# EAGLE design CNC3AX_V2 (EAGLE 4.16)
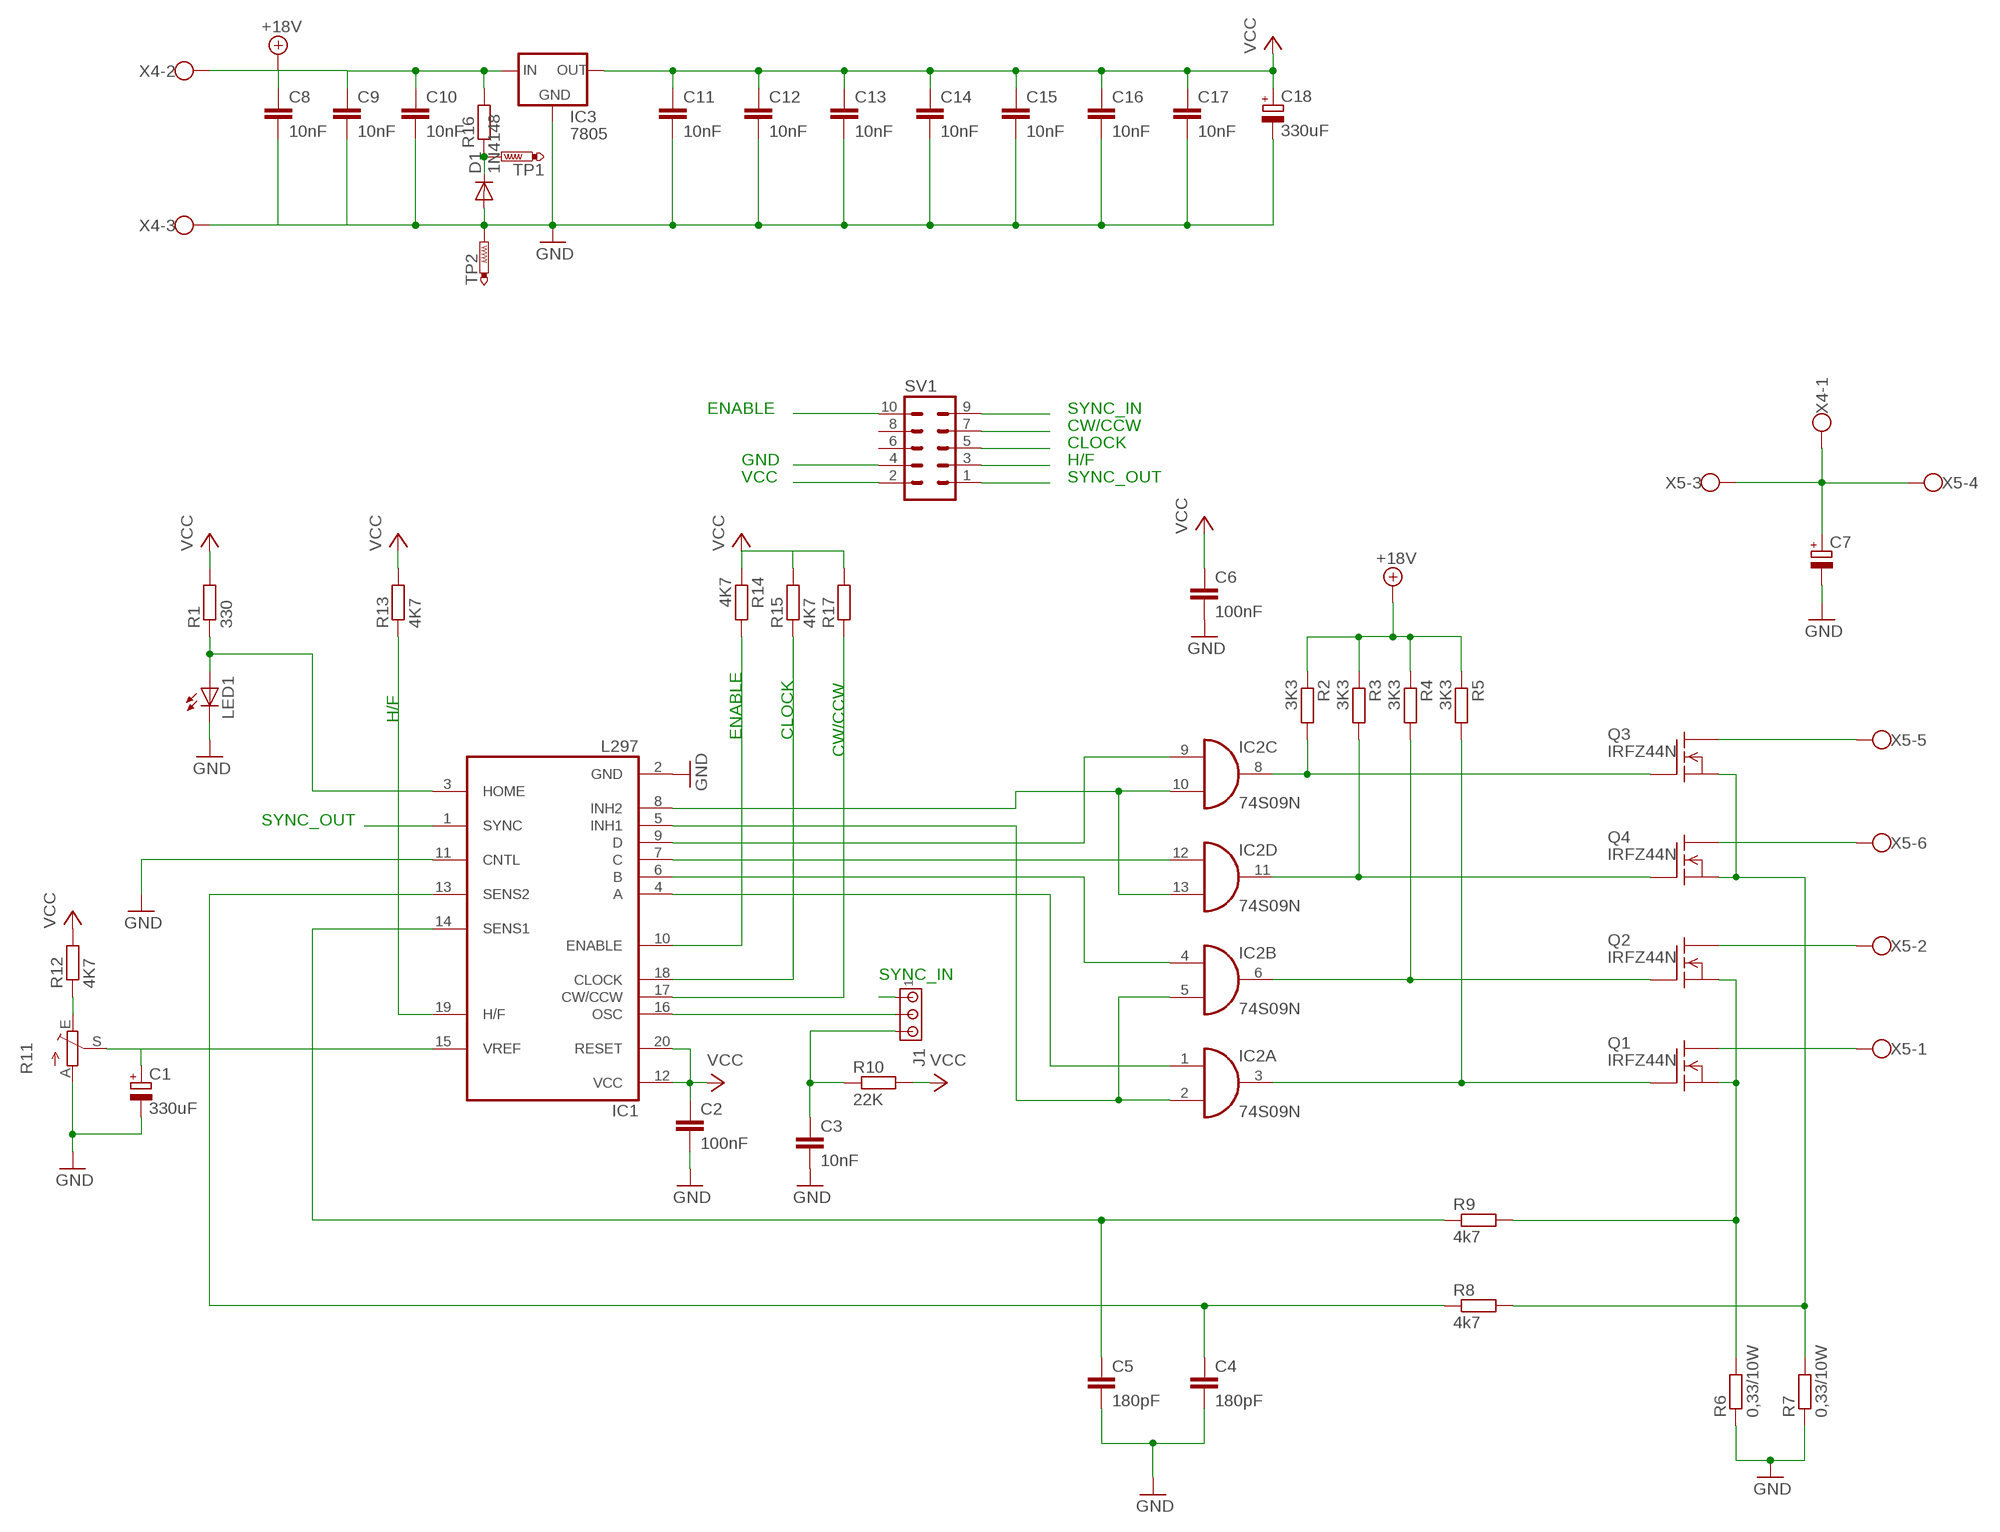
[diagram p0: schematic, sheet 1]

## Parts
C1  330uF  CPOL-EUE5-10.5  [E5-10,5]
C2  100nF  C-EU102-043X133  [C102-043X133]
C3  10nF  C-EU050-030X075  [C050-030X075]
C4  180pF  C-EU050-025X075  [C050-025X075]
C5  180pF  C-EU050-025X075  [C050-025X075]
C6  100nF  C-EU102-043X133  [C102-043X133]
C7  CPOL-EUE5-10.5  [E5-10,5]
C8  10nF  C-EU050-024X044  [C050-024X044]
C9  10nF  C-EU050-024X044  [C050-024X044]
C10  10nF  C-EU050-024X044  [C050-024X044]
C11  10nF  C-EU050-024X044  [C050-024X044]
C12  10nF  C-EU050-024X044  [C050-024X044]
C13  10nF  C-EU050-024X044  [C050-024X044]
C14  10nF  C-EU050-024X044  [C050-024X044]
C15  10nF  C-EU050-024X044  [C050-024X044]
C16  10nF  C-EU050-024X044  [C050-024X044]
C17  10nF  C-EU050-024X044  [C050-024X044]
C18  330uF  CPOL-EUE5-10.5  [E5-10,5]
D1  1N4148  [DO35-10]
IC1  L297  [DIL20]
IC2  74S09N  [DIL14]
IC3  7805  78XXS  [78XXS]
J1  MTA03-100  [10X03MTA]
LED1  LED5MM  [LED5MM]
Q1  IRFZ44N  IRF620  [TO220]
Q2  IRFZ44N  IRF620  [TO220]
Q3  IRFZ44N  IRF620  [TO220]
Q4  IRFZ44N  IRF620  [TO220]
R1  330  R-EU_0207/10  [0207/10]
R2  3K3  R-EU_0207/10  [0207/10]
R3  3K3  R-EU_0207/10  [0207/10]
R4  3K3  R-EU_0207/10  [0207/10]
R5  3K3  R-EU_0207/10  [0207/10]
R6  0,33/10W  R-EU_0613/15  [P0613/15]
R7  0,33/10W  R-EU_0613/15  [P0613/15]
R8  4k7  R-EU_0207/10  [0207/10]
R9  4k7  R-EU_0207/10  [0207/10]
R10  22K  R-EU_0207/5V  [0207/5V]
R11  TRIM_EU-CA9V  [CA9V]
R12  4K7  R-EU_0207/10  [0207/10]
R13  4K7  R-EU_0207/2V  [0207/2V]
R14  4K7  R-EU_0207/10  [0207/10]
R15  4K7  R-EU_0207/5V  [0207/5V]
R16  R-EU_0204/7  [0204/7]
R17  R-EU_0207/7  [0207/7]
SV1  MA05-2  [MA05-2]
TP1  PTR1PAD1-13Y  [P1-13Y]
TP2  PTR1PAD1-13Y  [P1-13Y]
X4  W237-103  [W237-103]
X5  W237-136  [W237-136]

## Nets
+18V: C8.1 C9.1 C10.1 IC3.IN R2.1 R3.1 R4.1 R5.1 R16.2 X4.2
CLOCK: IC1.18(CLOCK) R15.1 SV1.5
CW/CCW: IC1.17(CW/CCW) R17.1 SV1.7
ENABLE: IC1.10(ENABLE) R14.2 SV1.10
GND: C1.- C2.2 C3.2 C4.2 C5.2 C6.2 C7.- C8.2 C9.2 C10.2 C11.2 C12.2 C13.2 C14.2 C15.2 C16.2 C17.2 C18.- D1.A IC1.2(GND) IC1.11(CNTL) IC3.GND LED1.K(C) R6.1 R7.1 R11.A SV1.4 TP2.1(TP) X4.3
H/F: IC1.19(H/F) R13.1 SV1.3
N$1: IC1.4(A) IC2.1(A:I0)
N$2: IC1.6(B) IC2.4(B:I0)
N$3: IC1.7(C) IC2.12(D:I0)
N$4: IC1.9(D) IC2.9(C:I0)
N$5: IC1.5(INH1) IC2.2(A:I1) IC2.5(B:I1)
N$6: IC1.8(INH2) IC2.10(C:I1) IC2.13(D:I1)
N$7: D1.C R16.1 TP1.1(TP)
N$9: IC1.3(HOME) LED1.A R1.1
N$10: Q4.2(D) X5.6
N$15: Q3.2(D) X5.5
N$16: Q2.2(D) X5.2
N$17: IC2.8(C:O) Q3.1(G) R2.2
N$18: IC2.11(D:O) Q4.1(G) R3.2
N$19: IC2.6(B:O) Q2.1(G) R4.2
N$20: IC2.3(A:O) Q1.1(G) R5.2
N$21: Q3.3(S) Q4.3(S) R7.2 R8.2
N$22: Q1.3(S) Q2.3(S) R6.2 R9.2
N$23: C5.1 IC1.14(SENS1) R9.1
N$24: C4.1 IC1.13(SENS2) R8.1
N$25: C3.1 J1.3 R10.1
N$26: C1.+ IC1.15(VREF) R11.S
N$27: IC1.16(OSC) J1.2
N$28: R11.E R12.1
N$29: Q1.2(D) X5.1
SYNC_IN: J1.1 SV1.9
SYNC_OUT: IC1.1(SYNC) SV1.1
VCC: C2.1 C6.1 C11.1 C12.1 C13.1 C14.1 C15.1 C16.1 C17.1 C18.+ IC1.12(VCC) IC1.20(RESET) IC3.OUT R1.2 R10.2 R12.2 R13.2 R14.1 R15.2 R17.2 SV1.2
VMOTOR: C7.+ X4.1 X5.3 X5.4
Unconnected: SV1.6 SV1.8

## Notes on the sheet
- ENABLE | SYNC_IN
- CW/CCW
- CLOCK
- GND | H/F
- VCC | SYNC_OUT
- H/F
- ENABLE | CLOCK
- CW/CCW
- SYNC_OUT
- SYNC_IN

## Power pins joined to a net without a drawn wire
GND: IC2.7(P:GND)
VCC: IC2.14(P:VCC)

## Library data of the parts
C1 C7 C18 = rcl:CPOL-EU: POLARIZED CAPACITOR, European symbol
C2-C6 C8-C17 = rcl:C-EU: CAPACITOR, European symbol
D1 = diode:1N4148: DIODE high speed (Philips)
IC1 = st-microelectronics:L297: STEPPER MOTOR CONTROLLER
IC2 = 74xx-eu:74*09: Quad 2-input AND gate, open collector
IC3 = v-reg:78XXS: VOLTAGE REGULATOR
J1 = con-amp:MTA03-100: AMP connector
LED1 = led:LED: LED OSRAM: - CHIPLED LG R971, LG N971, LY N971, LG Q971, LY Q971, LO R971, LY R971 LH N974, LH R974 LS Q976, LO Q976, LY Q976 LO Q996 - Hyper CHIPLED LW Q18S LB Q993, LB Q99A, LB R99A - SideLED LS A670, LO A670, LY A670, LG A670, LP A670 LB A673, LV A673, LT A673, LW A673 LH A674 LY A675 LS A676, LA A676, LO A676, LY A676, LW A676 LS A679, LY A679, LG A679 - Hyper Micro SIDELED® LS Y876, LA Y876, LO Y876, LY Y876 LT Y87S - SmartLED LW L88C, LW L88S LB L89C, LB L89S, LG L890 LS L89K, LO L89K, LY L89K LS L896, LA L896, LO L896, LY L896 - TOPLED LS T670, LO T670, LY T670, LG T670, LP T670 LSG T670, LSP T670, LSY T670, LOP T670, LYG T670 LG T671, LOG T671, LSG T671 LB T673, LV T673, LT T673, LW T673 LH T674 LS T676, LA T676, LO T676, LY T676, LB T676, LH T676, LSB T676, LW T676 LB T67C, LV T67C, LT T67C, LS T67K, LO T67K, LY T67K, LW E67C LS E67B, LA E67B, LO E67B, LY E67B, LB E67C, LV E67C, LT E67C LW T67C LS T679, LY T679, LG T679 LS T770, LO T770, LY T770, LG T770, LP T770 LB T773, LV T773, LT T773, LW T773 LH T774 LS E675, LA E675, LY E675, LS T675 LS T776, LA T776, LO T776, LY T776, LB T776 LHGB T686 LT T68C, LB T68C - Hyper Mini TOPLED® LB M676 - Mini TOPLED Santana® LG M470 LS M47K, LO M47K, LY M47K Source: http://www.osram.convergy.de/
Q1-Q4 = transistor-fet:IRF620: N-Channel Enhancement MOSFET (HEXFET); 200V; 5,2A; 0,8Ohm
R1-R10 R12-R17 = rcl:R-EU_: RESISTOR, European symbol
R11 = pot:TRIM_EU-: POTENTIOMETER
SV1 = con-lstb:MA05-2: PIN HEADER
TP1 TP2 = testpad:PTR1: TEST PIN
X4 = con-wago-500:W237-103: WAGO SCREW CLAMP
X5 = con-wago-500:W237-136: WAGO SCREW CLAMP

## Board
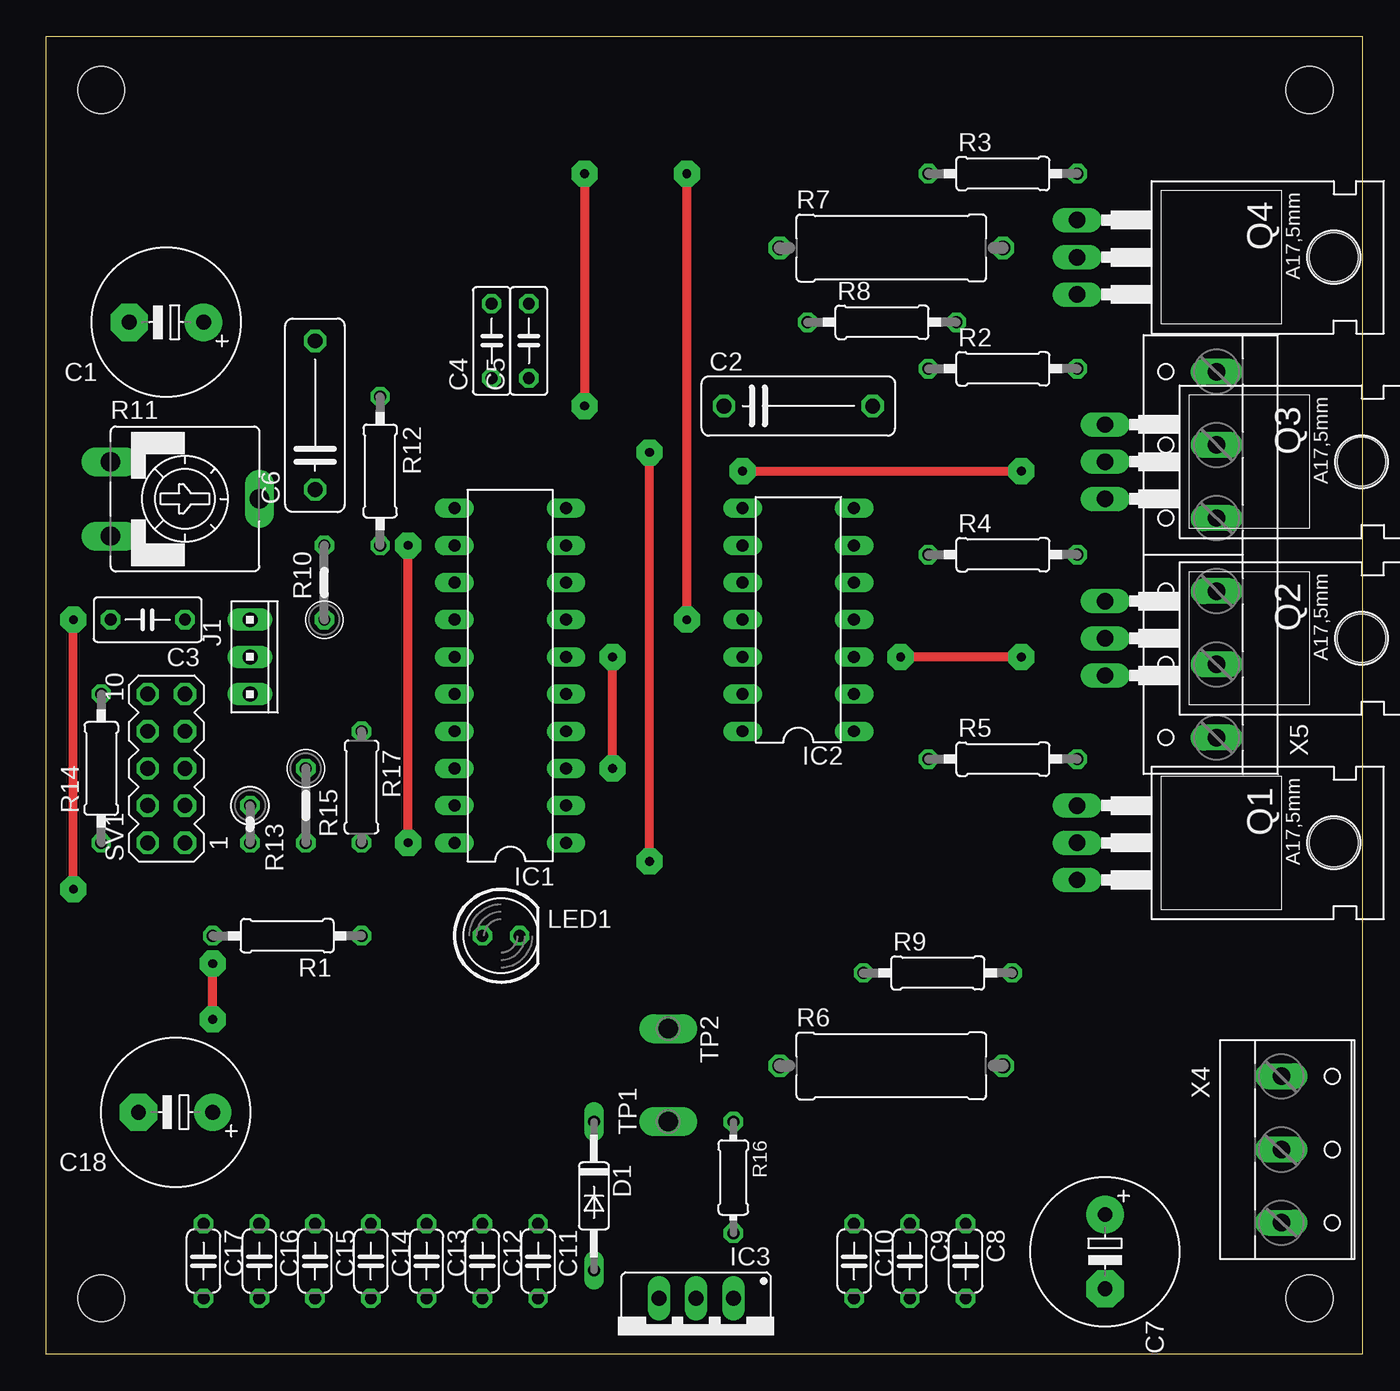
[diagram p1: board, top side]
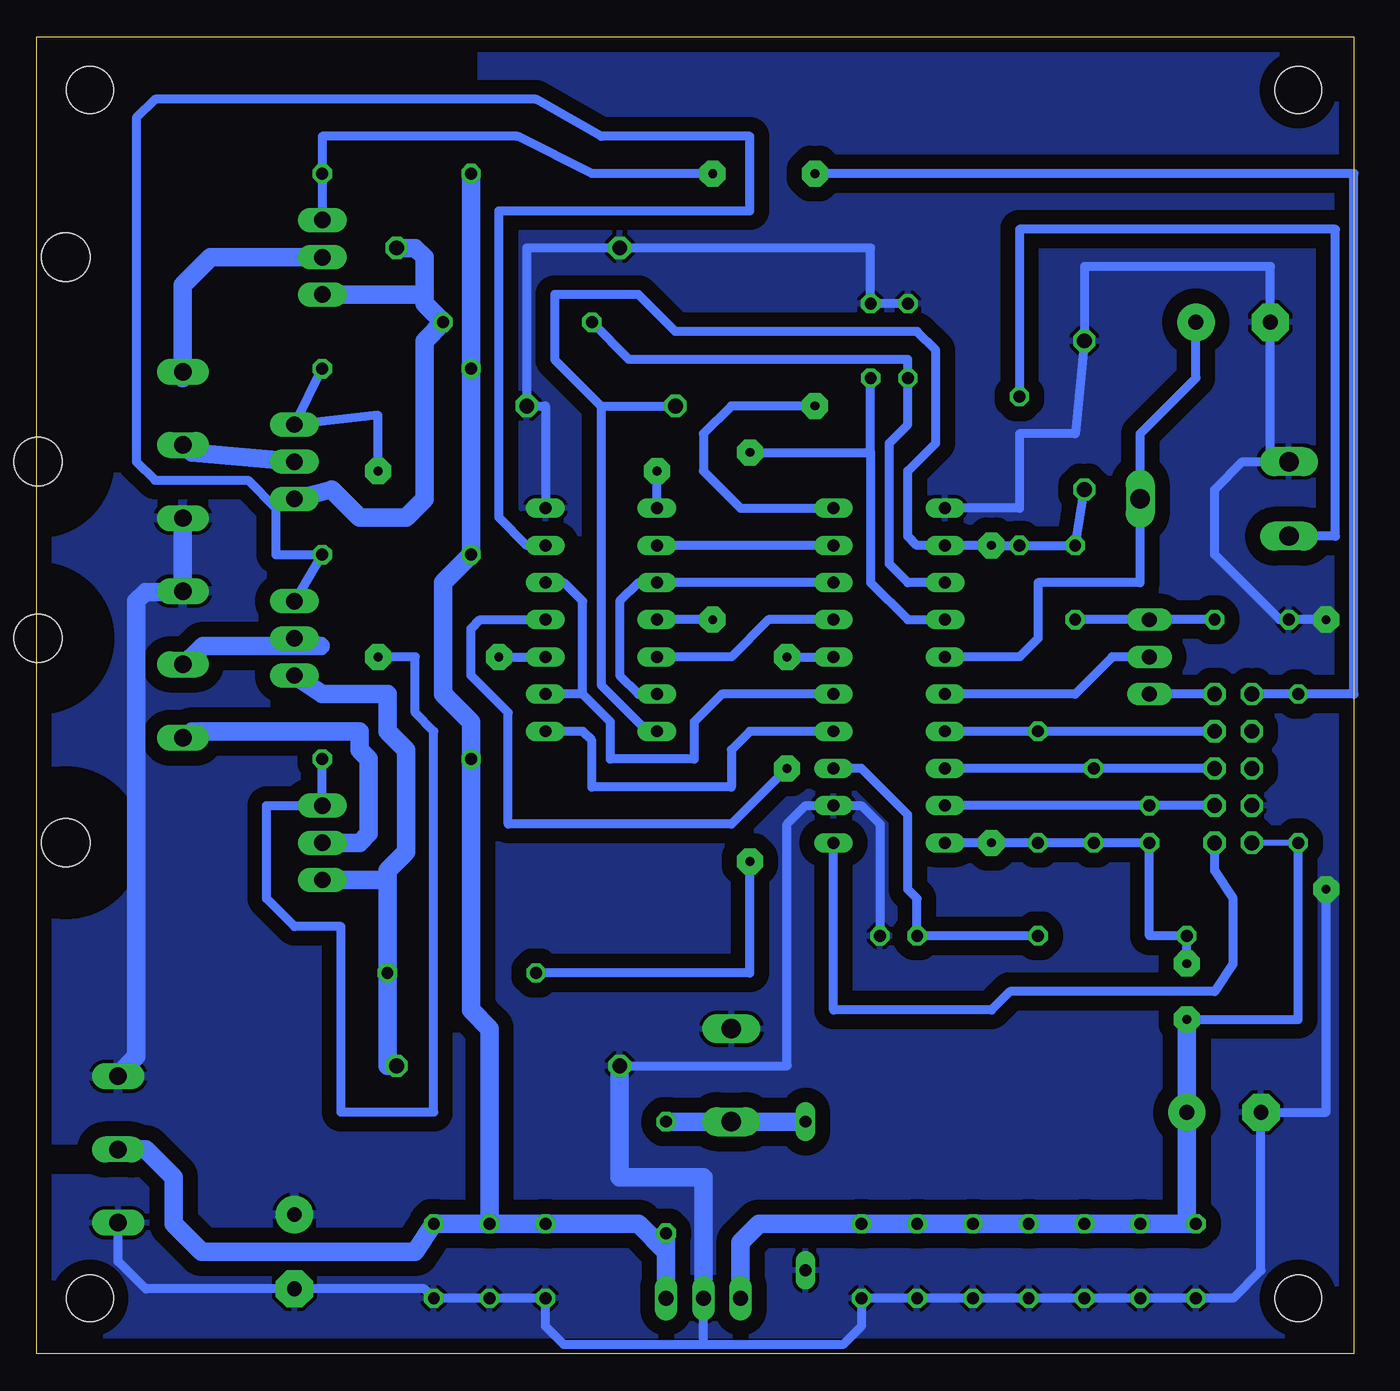
[diagram p2: board, bottom side, seen from below]

Size 90 x 90 mm. Coordinates in mm from the lower left corner, seen from the top.
Outline: 0,90 0,0 90,0 90,90 0,90
Copper layers (1*16): Top 0.035mm / dielectric 1.5mm / Bottom 0.035mm
Design rules "default": minimum track width 10mil, minimum drill 24mil, track to track 8mil, track to pad 8mil, pad to pad 8mil, via to via 8mil, smd to smd 8mil, copper to edge 40mil, drill to drill 8mil, minimum pad ring 10mil, minimum via ring 8mil, stop-mask expansion 4mil, vias tented up to drill 0mil, thermal gap 10mil
Holes 3.2 mm at 86.36,3.81 3.81,86.36 86.36,86.36 3.81,3.81

### Footprints (pad centres in the part's own frame; a part is rotated, then mirrored left to right if it is on the bottom)
E5-10,5 = drill 1.016 pad 2.54: + -2.54,0 | drill 1.016 pad 2.54 octagon: - 2.54,0
C102-043X133 = drill 1.016 octagon: 1 -5.08,0; 2 5.08,0
C050-030X075 = drill 0.813 octagon: 1 -2.54,0; 2 2.54,0
C050-025X075 = drill 0.813 octagon: 1 -2.54,0; 2 2.54,0
C050-024X044 = drill 0.813 octagon: 1 -2.54,0; 2 2.54,0
DO35-10 = drill 0.813 long: A 5.08,0; C -5.08,0
DIL20 = drill 0.813 long: 1 -11.43,-3.81; 2 -8.89,-3.81; 3 -6.35,-3.81; 4 -3.81,-3.81; 5 -1.27,-3.81; 6 1.27,-3.81; 7 3.81,-3.81; 8 6.35,-3.81; 9 8.89,-3.81; 10 11.43,-3.81; 11 11.43,3.81; 12 8.89,3.81; 13 6.35,3.81; 14 3.81,3.81; 15 1.27,3.81; 16 -1.27,3.81; 17 -3.81,3.81; 18 -6.35,3.81; 19 -8.89,3.81; 20 -11.43,3.81
DIL14 = drill 0.813 long: 1 -7.62,-3.81; 2 -5.08,-3.81; 3 -2.54,-3.81; 4 0,-3.81; 5 2.54,-3.81; 6 5.08,-3.81; 7 7.62,-3.81; 8 7.62,3.81; 9 5.08,3.81; 10 2.54,3.81; 11 0,3.81; 12 -2.54,3.81; 13 -5.08,3.81; 14 -7.62,3.81
78XXS = drill 1.016 long: GND 0,-2.54; IN -2.54,-2.54; OUT 2.54,-2.54
10X03MTA = drill 1.016 long: 1 2.54,0; 2 0,0; 3 -2.54,0
LED5MM = drill 0.813 octagon: A -1.27,0; K 1.27,0
TO220 = drill 1.118 long: 1 -2.54,-6.35; 2 0,-6.35; 3 2.54,-6.35 | hole 3.302: 0,11.176
0207/10 = drill 0.813 octagon: 1 -5.08,0; 2 5.08,0
P0613/15 = drill 1.016 octagon: 1 -7.62,0; 2 7.62,0
0207/5V = drill 0.813 octagon: 1 -2.54,0; 2 2.54,0
CA9V = drill 1.321 long: A -2.54,-5.08; E 2.54,-5.08; S 0,5.08
0207/2V = drill 0.813 octagon: 1 -1.27,0; 2 1.27,0
0204/7 = drill 0.813 octagon: 1 -3.81,0; 2 3.81,0
0207/7 = drill 0.813 octagon: 1 -3.81,0; 2 3.81,0
MA05-2 = drill 1.016 octagon: 1 -5.08,-1.27; 2 -5.08,1.27; 3 -2.54,-1.27; 4 -2.54,1.27; 5 0,-1.27; 6 0,1.27; 7 2.54,-1.27; 8 2.54,1.27; 9 5.08,-1.27; 10 5.08,1.27
P1-13Y = drill 1.321 pad 1.905 long: 1 0,0
W237-103 = drill 1.194 long: 1 -5,-1.29; 2 0,-1.29; 3 5,-1.29
W237-136 = drill 1.194 long: 1 -12.5,-1.27; 2 -7.5,-1.27; 3 -2.5,-1.27; 4 2.5,-1.27; 5 7.5,-1.27; 6 12.5,-1.27

### Placement (x,y rotation side)
C1  8.25,70.48 180 top
C2  51.43,64.77 0 top
C3  6.98,50.16 180 top
C4  30.47,69.21 90 top
C5  33.02,69.21 90 top
C6  18.41,64.13 90 top
C7  72.39,6.98 270 top
C8  62.86,6.35 270 top
C9  59.05,6.35 270 top
C10  55.24,6.35 270 top
C11  33.65,6.35 270 top
C12  29.84,6.35 270 top
C13  26.03,6.35 270 top
C14  22.22,6.35 270 top
C15  18.41,6.35 270 top
C16  14.6,6.35 270 top
C17  10.79,6.35 270 top
C18  8.88,16.5 180 top
D1  37.46,10.79 270 top
IC1  31.74,46.35 90 top
IC2  51.43,50.16 90 top
IC3  44.45,1.27 180 top
J1  13.96,47.62 270 top
LED1  31.11,28.57 0 top
Q1  76.83,34.92 270 top
Q2  78.73,48.89 270 top
Q3  78.73,60.95 270 top
Q4  76.83,74.92 270 top
R1  16.5,28.57 180 top
R2  65.4,67.3 0 top
R3  65.4,80.64 0 top
R4  65.4,54.6 0 top
R5  65.4,40.63 0 top
R6  57.78,19.68 0 top
R7  57.78,75.56 0 top
R8  57.14,70.48 0 top
R9  60.95,26.03 0 top
R10  19.04,52.7 90 top
R11  9.52,58.41 270 top
R12  22.86,60.32 270 top
R13  13.96,36.19 270 top
R14  3.81,40 90 top
R15  17.77,37.46 270 top
R16  46.98,12.06 270 top
R17  21.59,38.73 270 top
SV1  8.25,40 90 top
TP1  42.54,15.87 90 top
TP2  42.54,22.22 270 top
X4  85.72,13.96 270 top
X5  78.73,54.6 90 top

### Tracks (layer width: path | path; a pad name or v marks a point on that pad's centre or on a via)
+18V
  Bottom 1.27: X4.2 82.55,13.96 80.64,12.06 80.64,8.88 78.73,6.98 64.13,6.98 C8.1 C9.1 | C9.1 C10.1 48.89,8.88 46.98,6.98 | IC3.IN 46.98,6.98 | C9.1 59.05,22.22 60.32,23.49 R5.1 60.32,43.17 62.23,45.08 62.23,52.7 R4.1 60.32,57.78 | 60.32,57.78 R2.1 | 60.32,57.78 60.32,57.14 | 60.32,57.78 R3.1 | 46.98,6.98 R16.2
CLOCK
  Bottom 0.61: IC1.18 R15.1 SV1.5
CW/CCW
  Bottom 0.61: SV1.7 R17.1 IC1.17
ENABLE  (via drill 0.6 pad 1.78)
  Top 0.61: v36.83,80.64 v36.83,64.77
  Bottom 0.61: IC1.10 41.91,57.78 44.45,60.32 44.45,62.86 42.54,64.77 v36.83,64.77 | v36.83,80.64 -0.01,80.64 -0.01,45.08 R14.2 SV1.10
GND  (via drill 0.6 pad 1.78)
  Top 0.61: v1.9,31.74 v1.9,50.16
  Bottom 0.61: IC1.11 22.86,57.78 22.86,62.86 19.04,62.86 C6.2 18.41,74.29 5.71,74.29 C1.- 5.71,60.95 | X4.3 84.43,6.33 82.55,4.44 C7.- 63.5,4.44 C8.2 C9.2 C10.2 55.24,1.9 53.97,0.63 44.45,0.63 | 44.45,0.63 34.92,0.63 33.65,1.9 C11.2 C12.2 C13.2 C14.2 C15.2 C16.2 C17.2 8.25,3.81 6.35,5.71 C18.- 1.9,16.5 v1.9,31.74 | 44.45,0.63 IC3.GND | C4.2 C5.2 33.02,75.56 R7.1 56.51,75.56 C2.2 55.24,64.77 IC2.7 | 5.71,60.95 R11.A | 5.71,60.95 7.62,60.95 9.52,59.05 9.52,54.6 5.08,50.16 C3.2 v1.9,50.16 | R6.1 38.73,19.68 38.73,36.19 37.46,37.46 IC1.2 33.65,37.46 32.38,36.19 LED1.K
  Bottom 1.27: R6.1 50.16,12.06 44.45,12.06 IC3.GND
  pour Bottom (isolate 1.016): -0.01,89.53 59.69,89.53 59.69,12.06 89.53,12.06 89.53,0.63 -0.01,0.63
H/F
  Bottom 0.61: IC1.19 R13.1 SV1.3
N$1
  Bottom 0.61: IC1.4 41.27,42.54 42.54,41.27 42.54,38.73 52.06,38.73 52.06,41.91 52.7,42.54 IC2.1
N$2  (via drill 0.6 pad 1.78)
  Top 0.61: v38.73,40 v38.73,47.62
  Bottom 0.61: v38.73,47.62 IC1.6 | IC2.4 59.69,50.16 60.32,49.52 60.32,46.35 57.78,43.81 57.78,36.19 42.54,36.19 v38.73,40
N$3
  Bottom 0.61: IC2.12 42.54,47.62 40,50.16 IC1.7
N$4
  Bottom 0.61: IC1.9 IC2.9
N$5
  Bottom 0.61: IC1.5 43.17,45.08 45.08,43.17 45.08,40.63 50.8,40.63 50.8,43.17 52.7,45.08 | IC2.5 53.97,52.7 52.7,51.43 52.7,45.08 | 52.7,45.08 IC2.2
N$6
  Bottom 0.61: IC1.8 IC2.10 48.89,52.7 50.16,51.43 50.16,46.35 48.89,45.08 IC2.13
N$7
  Bottom 1.27: R16.1 TP1.1 D1.C
N$9
  Bottom 0.61: IC1.3 33.65,40 30.47,36.83 30.47,31.74 29.84,31.11 LED1.A R1.1
N$10
  Bottom 1.27: Q4.2 78.1,74.92 80,73.02 X5.6 80,66.67
N$15
  Bottom 1.27: X5.5 80,62.23 79.37,61.59 Q3.2
N$16
  Bottom 1.27: Q2.2 70.6,48.38 78.61,48.38 80,46.98 X5.2
N$17  (via drill 0.6 pad 1.78)
  Top 0.61: v47.62,60.32 v66.67,60.32
  Bottom 0.61: IC2.8 v47.62,60.32 | v66.67,60.32 66.67,64.13 Q3.1 R2.2
N$18  (via drill 0.6 pad 1.78)
  Top 0.61: v43.81,50.16 v43.81,80.64
  Bottom 0.61: v43.81,50.16 IC2.11 | v43.81,80.64 52.06,80.64 57.14,83.18 70.48,83.18 R3.2 Q4.1
N$19
  Bottom 0.61: IC2.6 56.51,55.24 58.41,57.14 58.41,78.1 41.27,78.1 41.27,83.18 51.43,83.18 55.88,85.72 81.91,85.72 83.18,84.45 83.18,60.95 81.91,59.69 75.56,59.69 73.66,57.78 73.66,54.6 R4.2 Q2.1
N$20  (via drill 0.6 pad 1.78)
  Top 0.61: v66.67,47.62 v58.41,47.62
  Bottom 0.61: v66.67,47.62 64.13,47.62 64.13,43.81 62.86,42.54 62.86,16.5 69.21,16.5 69.21,29.2 72.39,29.2 74.29,31.11 74.29,37.46 Q1.1 R5.2 | v58.41,47.62 IC2.3
N$21
  Bottom 1.27: Q3.3 69.84,59.05 67.94,57.14 64.77,57.14 63.5,58.41 63.5,69.21 R8.2 63.5,71.75 63.5,72.39 | R7.2 64.13,75.56 63.5,74.92 63.5,72.39 | 63.5,72.39 Q4.3
N$22
  Bottom 1.27: R6.2 66.03,19.68 R9.2 | R9.2 66.03,32.38 Q1.3 | Q2.3 70.48,45.08 66.03,45.08 66.03,42.54 64.77,41.27 64.77,34.28 66.03,33.02 R9.2
N$23  (via drill 0.6 pad 1.78)
  Top 0.61: v41.27,33.65 v41.27,61.59
  Bottom 0.61: IC1.14 30.47,50.16 33.02,52.7 33.02,61.59 | 33.02,61.59 C5.1 | R9.1 41.27,26.03 v41.27,33.65 | v41.27,61.59 33.02,61.59
N$24
  Bottom 0.61: IC1.13 30.47,52.7 31.74,53.97 31.74,62.23 30.47,63.5 C4.1 30.47,67.94 49.52,67.94 R8.1
N$25
  Bottom 0.61: C3.1 J1.3 R10.1
N$26
  Bottom 0.61: IC1.15 22.86,47.62 21.59,48.89 21.59,52.7 14.6,52.7 R11.S 14.6,62.86 10.79,66.67 C1.+
N$27
  Bottom 0.61: IC1.16 19.04,45.08 16.5,47.62 J1.2
N$28
  Bottom 0.61: R12.1 22.86,76.83 1.27,76.83 1.27,55.88 R11.E
N$29
  Bottom 1.27: Q1.2 67.94,34.92 67.3,35.55 67.3,40.63 67.94,41.27 67.94,42.54 79.37,42.54 80,41.91 X5.1
SYNC_IN
  Bottom 0.61: SV1.9 J1.1
SYNC_OUT
  Bottom 0.61: IC1.1 35.55,23.49 24.76,23.49 23.49,24.76 9.52,24.76 8.25,26.66 8.25,31.11 9.52,33.02 SV1.1
VCC  (via drill 0.6 pad 1.78)
  Top 0.61: v11.42,22.86 v11.42,26.66 | v24.76,34.92 v24.76,55.24
  Bottom 0.406: R14.1 SV1.2
  Bottom 0.61: IC2.14 48.26,42.54 51.43,45.71 51.43,64.77 | 51.43,64.77 54.6,67.94 54.6,72.39 48.89,72.39 46.35,69.84 29.84,69.84 28.57,68.58 28.57,62.23 30.47,60.32 30.47,55.88 29.84,55.24 IC1.12 v24.76,55.24 R12.2 R10.2 C6.1 | 51.43,64.77 C2.1 | v11.42,26.66 R1.2 13.96,28.57 R13.2 R15.2 R17.2 v24.76,34.92 IC1.20 | R14.1 3.81,22.86 v11.42,22.86
  Bottom 1.27: IC3.OUT 41.91,7.62 40.63,8.88 C11.1 C12.1 C13.1 C14.1 C15.1 C16.1 11.42,8.88 | C17.1 11.42,8.88 | 11.42,8.88 C18.+ v11.42,22.86
VMOTOR
  Bottom 1.27: X5.4 X5.3 80,52.06 82.55,52.06 83.18,51.43 83.18,20.31 84.45,19.04 84.43,19.02 X4.1
  pour Bottom (isolate 1.016): 89.53,89.53 60.95,89.53 60.95,6.98 80.64,6.98 80.64,14.6 89.53,14.6